# EAGLE design sd_slot (EAGLE 6.1)
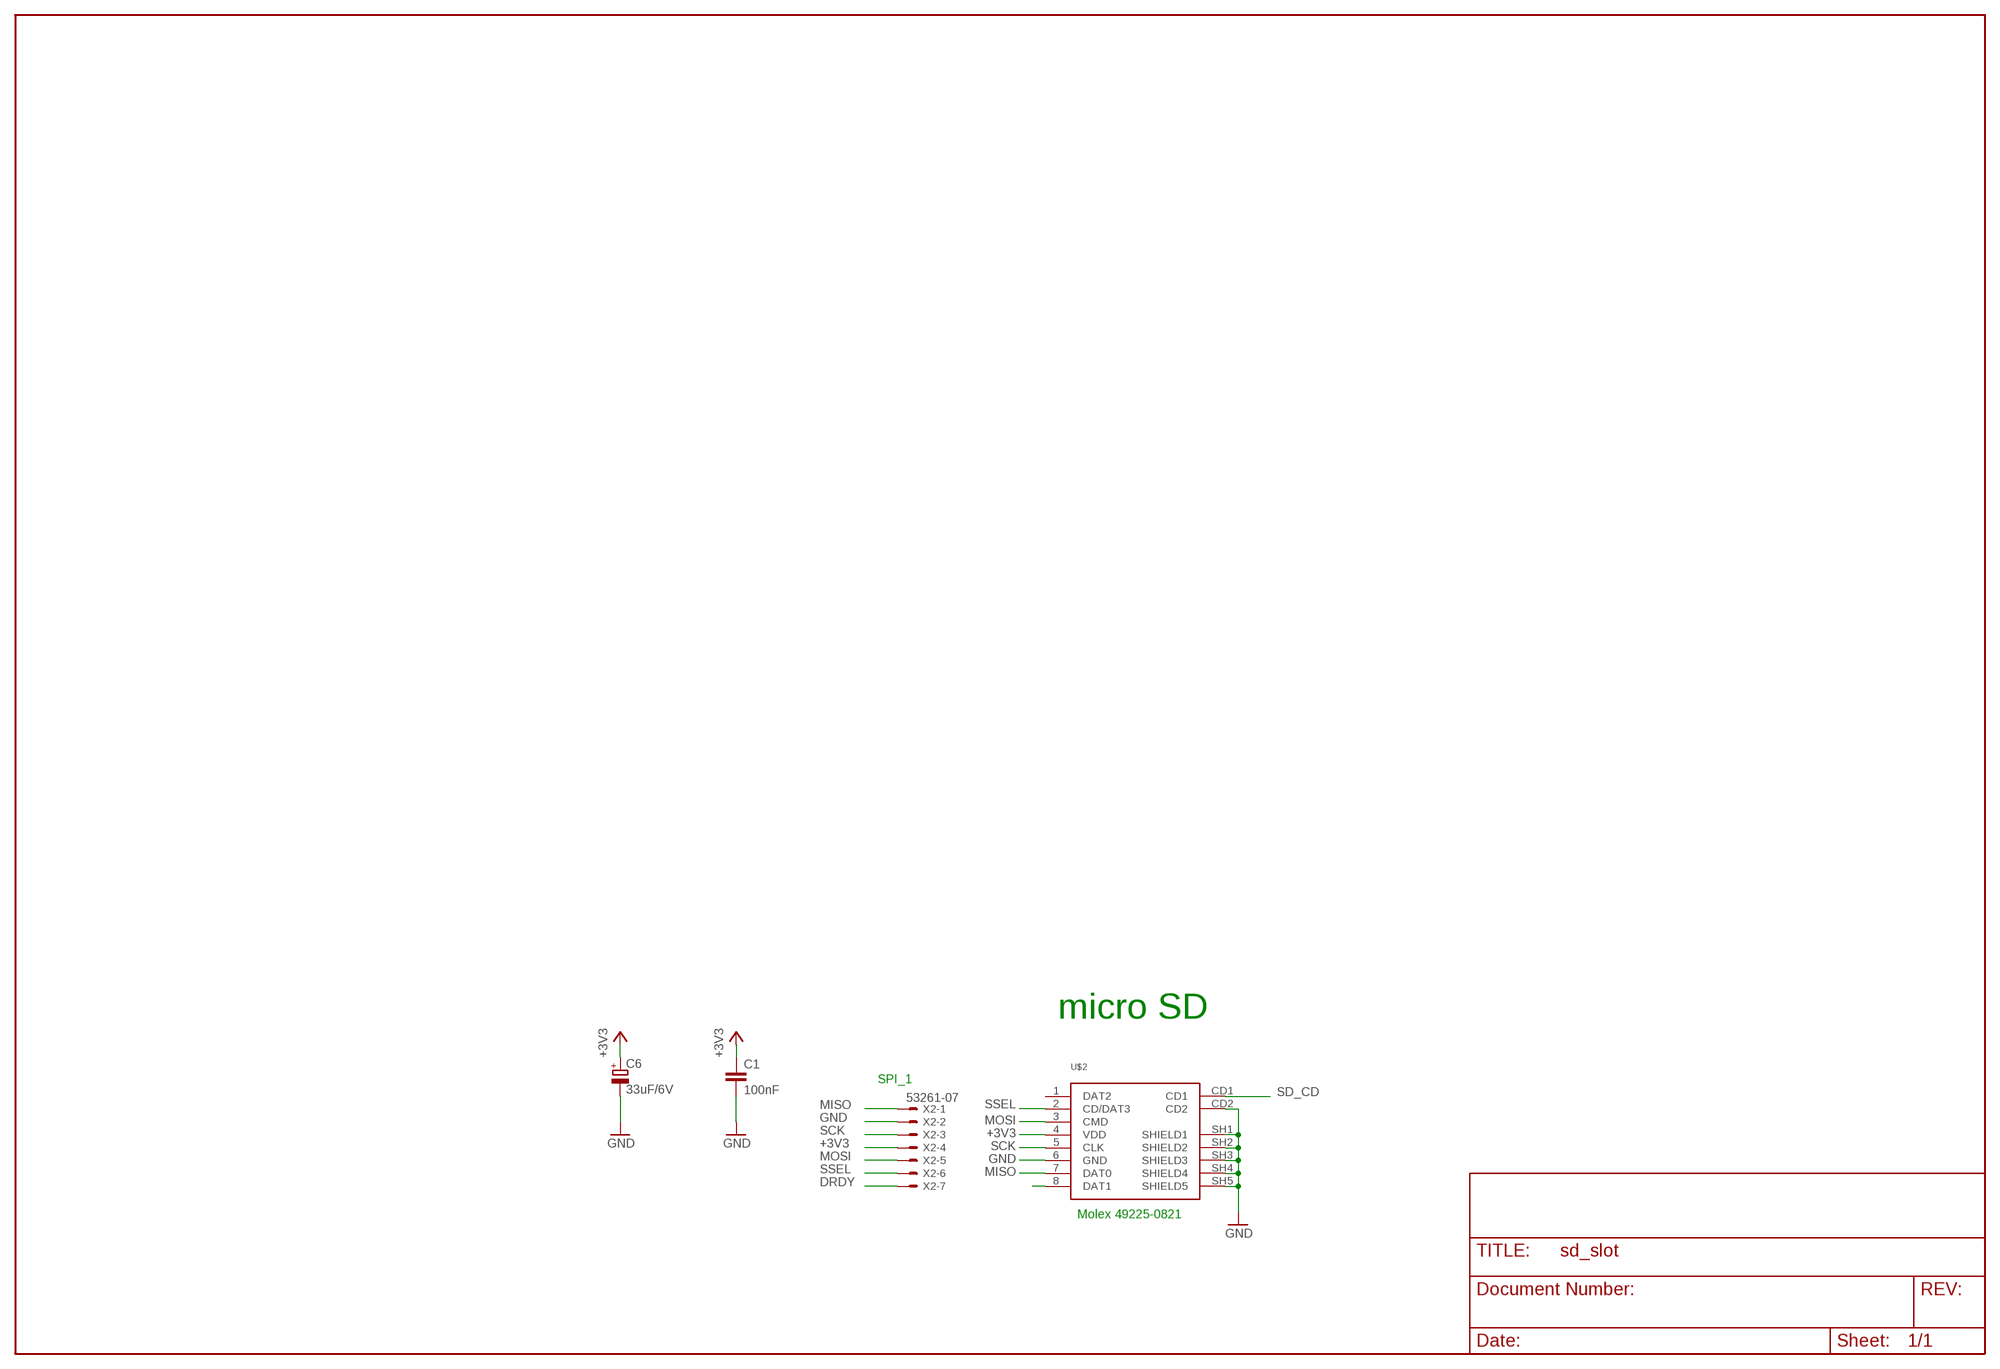
[diagram p0: schematic, sheet 1]

## Parts
C1  100nF  C-EUC0603  [C0603]
C6  33uF/6V  CPOL-EUCT3216  [CT3216]
U$2  MICRO_SD  [SD-MOLEX-49225]
X2  53261-07  [53261-07]

## Nets
+3V3: C1.1 C6.+ U$2.4(VDD) X2.4
DRDY: X2.7
GND: C1.2 C6.- U$2.6(GND) U$2.CD2 U$2.SH1(SHIELD1) U$2.SH2(SHIELD2) U$2.SH3(SHIELD3) U$2.SH4(SHIELD4) U$2.SH5(SHIELD5) X2.2
MISO: U$2.7(DAT0) X2.1
MOSI: U$2.3(CMD) X2.5
N$8: U$2.8(DAT1)
SCK: U$2.5(CLK) X2.3
SD_CD: U$2.CD1
SSEL: U$2.2(CD/DAT3) X2.6
Unconnected: U$2.1(DAT2)

## Notes on the sheet
- micro SD
- SPI_1
- Molex 49225-0821

## Library data of the parts
C1 = rcl:C-EU: CAPACITOR, European symbol
C6 = rcl:CPOL-EU: POLARIZED CAPACITOR, European symbol
U$2 = paparazzi:MICRO_SD
X2 = con-molex:53?-07: CONNECTOR wire to board 1.25 mm (.049 inch) pitch header

## Board
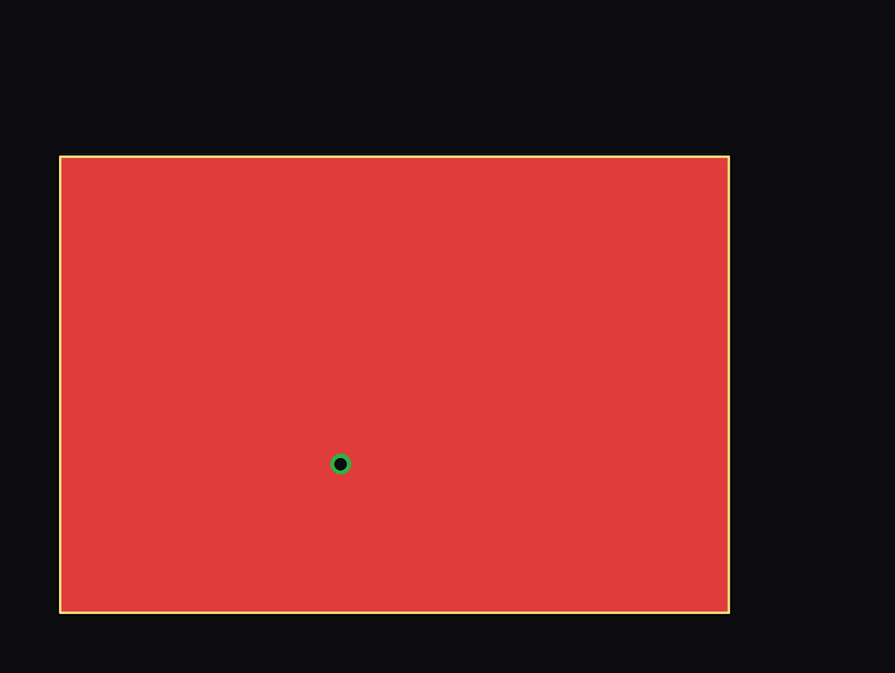
[diagram p1: board, top side]
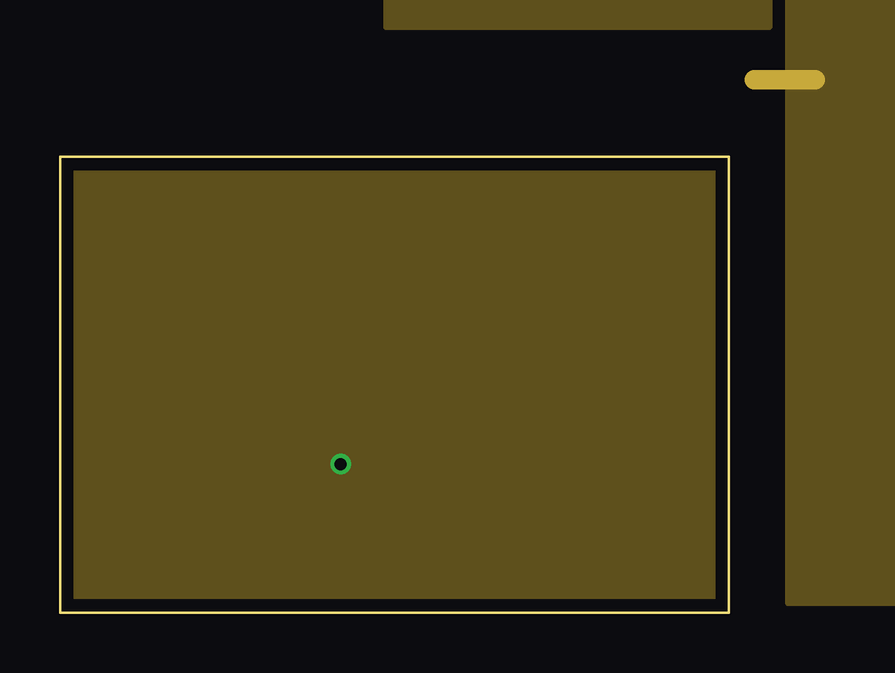
[diagram p2: board, inner layer Route2]
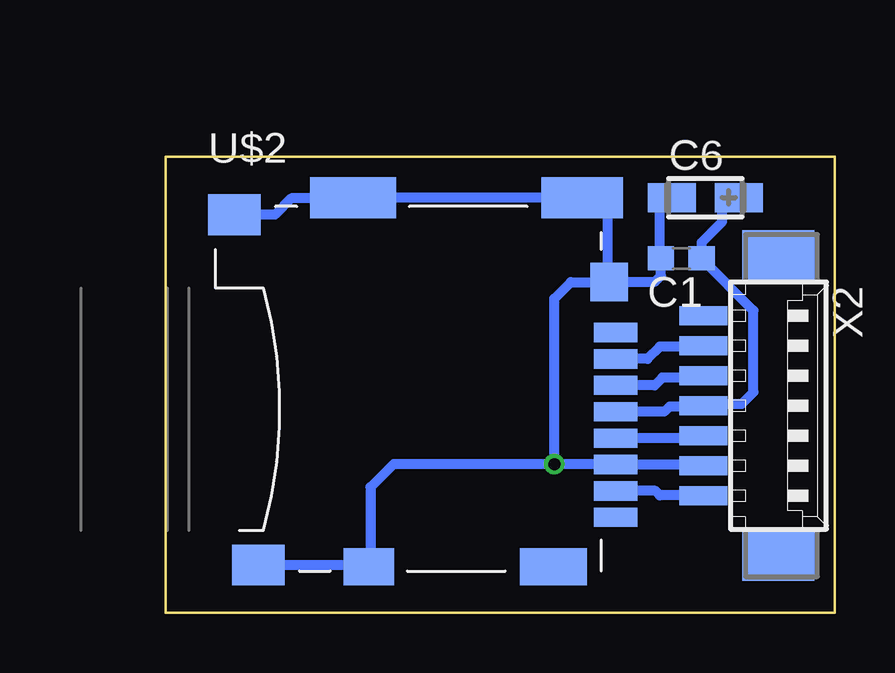
[diagram p3: board, bottom side, seen from below]

Size 27.89 x 19 mm. Coordinates in mm from the lower left corner, seen from the top.
Outline: 0,0 0,19 27.89,19 27.89,0 0,0
Copper layers (1*2+15*16): Top 0.035mm / dielectric 0.2mm / Route2 0.035mm / dielectric 1.5mm / Route15 0.035mm / dielectric 0.2mm / Bottom 0.035mm
Design rules: minimum track width 0.15mm, minimum drill 0.35mm, track to track 0.15mm, track to pad 0.15mm, pad to pad 0.15mm, via to via 0.15mm, smd to smd 0.15mm, copper to edge 20mil, drill to drill 8mil, minimum pad ring 0.177mm, minimum via ring 0.177mm, stop-mask expansion 4mil, vias tented up to drill 0mil, thermal gap 10mil

### Footprints (pad centres in the part's own frame; a part is rotated, then mirrored left to right if it is on the bottom)
C0603 = smd 1.1 x 1: 1 -0.85,0; 2 0.85,0
CT3216 = smd 2 x 1.2: + 1.4,0; - -1.4,0
SD-MOLEX-49225 = smd 0.8 x 1.8: 1 -10.54,16.7; 2 -9.44,16.7; 3 -8.34,16.7; 4 -7.24,16.7; 5 -6.14,16.7; 6 -5.04,16.7; 7 -3.94,16.7; 8 -2.84,16.7 | smd 1.55 x 2.8: CD1 -0.775,14.1 | smd 1.55 x 2.1: CD2 -0.775,6.4 | smd 1.7 x 2.2: SH1 -0.85,1.8; SH5 -15.45,0.8 | smd 1.6 x 1.55: SH2 -12.64,16.425 | smd 1.7 x 3.4: SH3 -16.15,15.3 | smd 1.7 x 3.6: SH4 -16.15,5.75
53261-07 = smd 0.8 x 2: 1 3.75,-2.5; 2 2.5,-2.5; 3 1.25,-2.5; 4 0,-2.5; 5 -1.25,-2.5; 6 -2.5,-2.5; 7 -3.75,-2.5 | smd 2.1 x 3: S1 6.25,0.625; S2 -6.25,0.625

### Placement (x,y rotation side)
C1  6.41,14.77 180 bottom
C6  5.4,17.3 0 bottom
U$2  25.84,1.14 270 bottom
X2  2.98,8.64 270 bottom

### Tracks (layer width: path | path; a pad name or v marks a point on that pad's centre or on a via)
+3V3
  Bottom 0.406: U$2.4 7.12,8.38 6.9,8.6 5.5,8.6 | 5.5,8.6 5.48,8.62 X2.4 | 5.5,8.6 5.4,8.7 3.9,8.7 3.4,9.2 3.4,12.6 5.56,14.76 C1.1 5.56,15.44 4.7,16.3 4.7,17.2 4,17.2 C6.+
AGND
  Route2 0.813: 28.96,22.23 31.5,22.23
  pour Route2 (isolate 0.203): 30.35,39.37 51.31,39.37 51.31,22.61 arc90 48.77,20.07 arc90 51.31,17.53 51.31,0.38 30.35,0.38
  pour Route2 (isolate 0.203): 51.31,39.37 69.6,39.37 69.6,0.38 51.31,0.38 51.31,17.53 arc90 53.85,20.07 arc90 51.31,22.61
  pour Route2 (no thermals): 29.59,24.38 13.59,24.38 13.59,39.37 29.59,39.37
GND  (via drill 0.5 pad 0.3)
  Bottom 0.406: U$2.SH5 23.34,16.59 22.66,17.27 19.87,17.27 19.89,17.29 U$2.SH4 10.62,17.29 10.54,17.21 | 10.54,17.21 10.47,17.14 | 10.54,17.21 U$2.SH3 9.46,17.29 9.46,13.78 | 9.46,13.78 U$2.SH2 9.41,13.71 9.4,13.7 9.3,13.8 7.5,13.8 7.26,14.04 C1.2 7.3,14.77 | 19.36,1.92 19.36,1.91 | 19.36,1.92 U$2.CD2 | 19.36,1.99 U$2.SH1 | 19.36,1.99 19.36,1.92 | X2.2 5.48,6.18 5.5,6.2 5.52,6.18 U$2.6 9.12,6.18 9.1,6.2 v11.7,6.2 | 19.36,1.99 19.36,5.24 18.4,6.2 v11.7,6.2 | 9.46,13.78 11.02,13.78 11.7,13.1 v11.7,6.2 | 7.3,14.77 7.3,14.7 | C6.- 7.3,17.3 7.3,14.77
  pour Route2 (isolate 0.203): 0.25,39.62 13.08,39.62 13.08,23.88 29.59,23.88 29.59,0.38 0.25,0.38
MISO
  Bottom 0.406: U$2.7 7.48,5.08 7.3,4.9 5.5,4.9 X2.1
MOSI
  Bottom 0.406: U$2.3 7.52,9.48 7.2,9.8 5.5,9.8 5.41,9.89 | 5.41,9.89 5.4,9.9 | X2.5 5.41,9.89
SCK
  Bottom 0.406: X2.3 5.48,7.32 5.52,7.28 U$2.5
SSEL
  Bottom 0.406: U$2.2 7.82,10.58 7.3,11.1 5.5,11.1 5.48,11.12 X2.6
(copper drawn outside any net)
  shapes: Top area x1